# Altium project pressure_esp.PrjPcb
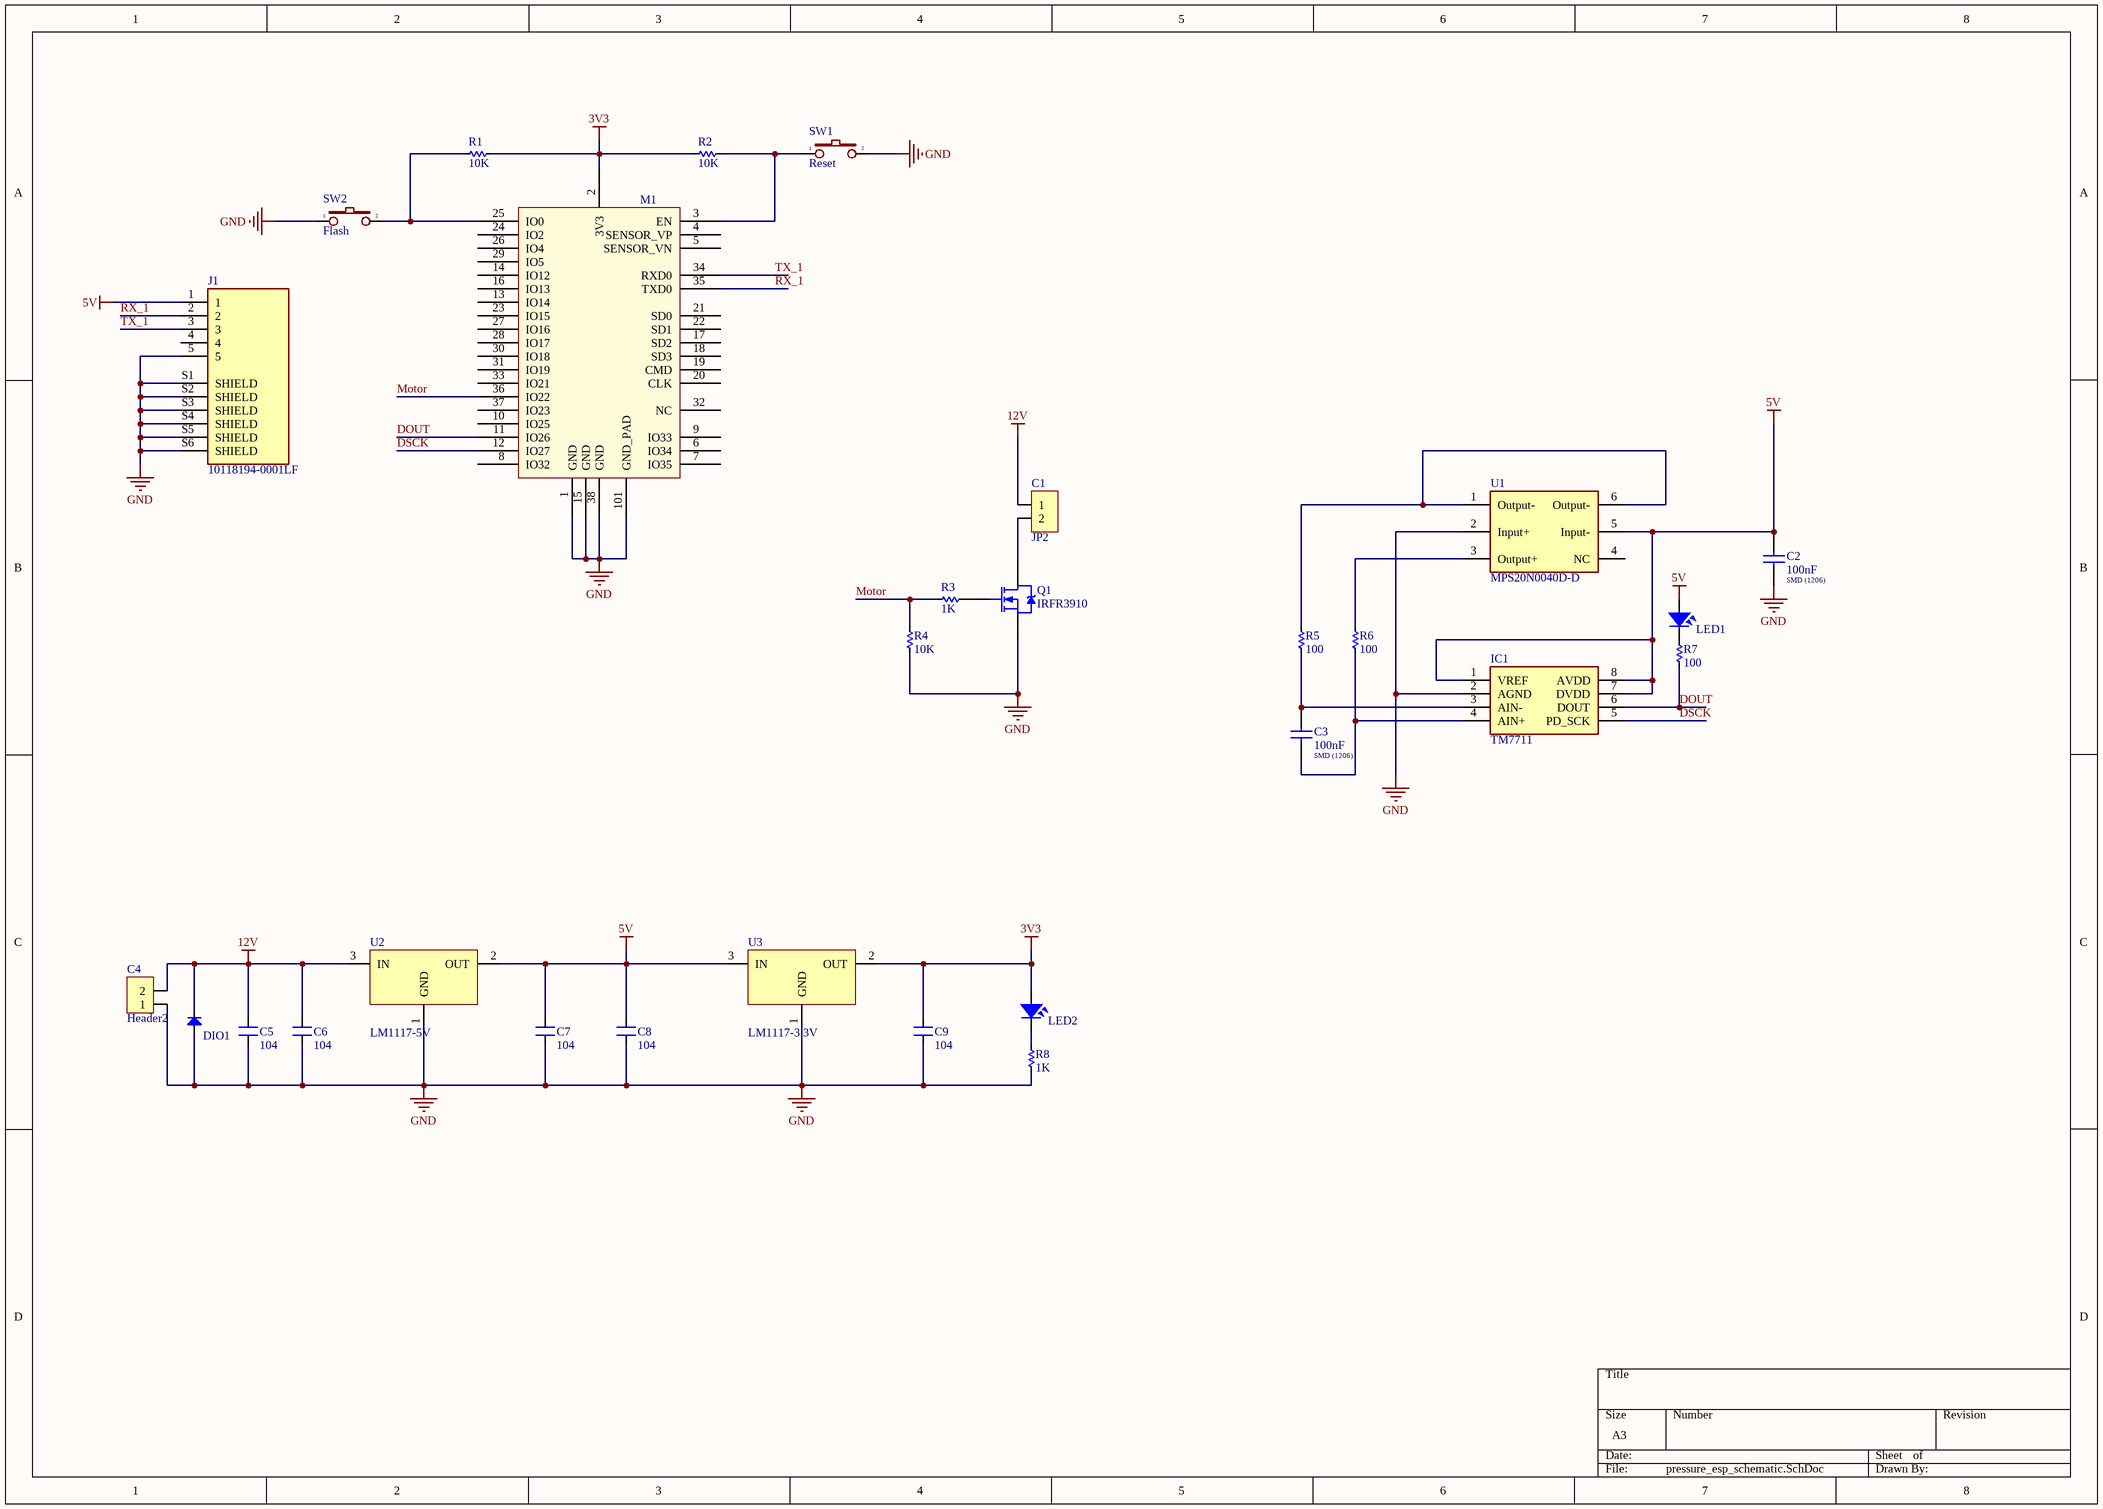
[diagram p0: pressure_esp_schematic.SchDoc]
1 sheet, 29 parts. Net scope: global (net labels, ports and power ports of the same name join across sheets).
Board file: pressure_esp_pcb.PcbDoc

## Sheet pressure_esp_schematic.SchDoc
size A3

### Parts
C1  JP2  [JP2-D1T]
C2  Valor: 100nF  Encapsulamento: SMD (1206)  [CAP_0603]  (hidden comment: Capacitor SMD)
C3  Valor: 100nF  Encapsulamento: SMD (1206)  [CAP_0603]  (hidden comment: Capacitor SMD)
C4  Header2  [Header2]
C5  104  [SM-CAP-0805]
C6  104  [SM-CAP-0805]
C7  104  [SM-CAP-0805]
C8  104  [SM-CAP-0805]
C9  104  [SM-CAP-0805]
DIO1  Diode SMD  [DIO-SMD-106]  (value not drawn)
IC1  TM7711  [SOIC127P600X196-8N]
J1  10118194-0001LF  [AMPHENOL_10118194-0001LF]
LED1  LED  [LED-0805-Blue]  (value not drawn)
LED2  LED  [LED-0805-Blue]  (value not drawn)
M1  ESP32S_Module  [ESP32S]  (value not drawn)
Q1  IRFR3910  [TO-252AA_N]
R1  10K  [RES-SMD-0603]
R2  10K  [RES-SMD-0603]
R3  1K  [RES-SMD-0603]
R4  10K  [RES-SMD-0603]
R5  100  [RES-SMD-0603]
R6  100  [RES-SMD-0603]
R7  100  [RES-SMD-0603]
R8  1K  [RES-SMD-0603]
SW1  Reset  [SW1-SMD]
SW2  Flash  [SW-DIP1-1]
U1  MPS20N0040D-D  [XDCR_ADP5241]
U2  LM1117-5V  [SOT223]
U3  LM1117-3.3V  [SOT223]

### Nets
3V3: C9.2 LED2.1 M1.2(3V3) R1.1 R2.2 U3.2(OUT)
5V: C2.2 C7.2 C8.2 IC1.1(VREF) IC1.7(DVDD) IC1.8(AVDD) J1.1 LED1.1 U1.5(Input-) U2.2(OUT) U3.3(IN)
12V: C1.1 C4.2 C5.2 C6.2 DIO1.2(K) U2.3(IN)
GND: C2.1 C4.1 C5.1 C6.1 C7.1 C8.1 C9.1 DIO1.1(A) IC1.2(AGND) J1.5 J1.S1(SHIELD) J1.S2(SHIELD) J1.S3(SHIELD) J1.S4(SHIELD) J1.S5(SHIELD) J1.S6(SHIELD) M1.1(GND) M1.15(GND) M1.38(GND) M1.101(GND_PAD) Q1.3(S) R4.2 R8.2 SW1.2 SW2.1 U1.2(Input+) U2.1(GND) U3.1(GND)
DOUT: IC1.6(DOUT) M1.11(IO26) R7.2
DSCK: IC1.5(PD_SCK) M1.12(IO27)
Motor: M1.36(IO22) R3.1 R4.1
RX_1: J1.2 M1.35(TXD0)
TX_1: J1.3 M1.34(RXD0)
NetC1_2: C1.2 Q1.4(D)
NetC3_1: C3.1 IC1.4(AIN+) R6.2
NetC3_2: C3.2 IC1.3(AIN-) R5.2
NetLED1_2: LED1.2 R7.1
NetLED2_2: LED2.2 R8.1
NetM1_3: M1.3(EN) R2.1 SW1.1
NetM1_25: M1.25(IO0) R1.2 SW2.2
NetQ1_1: Q1.1(G) R3.2
NetR5_1: R5.1 U1.1(Output-) U1.6(Output-)
NetR6_1: R6.1 U1.3(Output+)

Not connected (* = marked no-connect by the designer): J1 4; M1 4(SENSOR_VP) 5(SENSOR_VN) 6(IO34) 7(IO35) 8(IO32) 9(IO33) 10(IO25) 13(IO14) 14(IO12) 16(IO13) 17(SD2) 18(SD3) 19(CMD) 20(CLK) 21(SD0) 22(SD1) 23(IO15) 24(IO2) 26(IO4) 27(IO16) 28(IO17) 29(IO5) 30(IO18) 31(IO19) 32(NC) 33(IO21) 37(IO23); U1 4(NC)

### Library data of the parts
C1 = JP2: WR-PHD 2.54 mm Angled Socket Header; Manufacturer: W¨¹rth Elektronik eiSos GmbH; partNo: 613002143121; ComponentLink1 Description: Manufacturer; ComponentLink2 Description: Datasheet; NoPins: 02; Created Date: 29 March 2013; ComponentLink1URL: http://www.we-online.com; ComponentLink2URL: http://katalog.we-online.de/em/datasheet/6130xx143121.pdf; Created by: Karrer Zheng
C4 = Header2: Header IDC, 2 x 1 Pin Vertical 2.54mm Pitch (Non-Boxed, Male); Manufacturer: W¨¹rth Elektronik eiSos GmbH; partNo: 613002143121; ComponentLink1 Description: Manufacturer; ComponentLink2 Description: Datasheet; NoPins: 02; Created Date: 29 March 2013; ComponentLink1URL: http://www.we-online.com; ComponentLink2URL: http://katalog.we-online.de/em/datasheet/6130xx143121.pdf; Created by: Karrer Zheng
C5-C9 = CN: Value: 0,1uF/300V; Designed by: VanDungEvn
DIO1 = Diode SMD: Default Diode; Code - JEDEC: DO-214-AB; Value: 1N5007; Published: 8-Jun-2000; Revision: July-2002: Re-released for DXP Platform.; Publisher: Altium Limited
IC1 = TM7711: Integrated Circuit; Manufacturer_Name: Shenzhen Titan Micro Elec; Datasheet Link: https://datasheet.lcsc.com/szlcsc/Shenzhen-Titan-Micro-Elec-TM7711_C80695.pdf; Height: 1.96mm; Manufacturer_Part_Number: TM7711
J1 = 10118194-0001LF: USB - micro B USB 2.0 Receptacle Connector 5 Position Surface Mount, Right Angle; Through Hole; MF: Amphenol ICC; Package: None; Price: None; Availability: Unavailable; MP: 10118194-0001LF; SnapEDA_Link: https://www.snapeda.com/parts/10118194-0001LF/Amphenol%20FCI/view-part/1413308/?ref=snap; Value: *
LED1 LED2 = LED SMD: Value: LED 3 - 5 ly 2 Colour
M1 = ESP32S_Module: Esp-32S; Datasheet: https://espressif.com/sites/default/files/documentation/esp_wroom_32_datasheet_en.pdf
Q1 = IRFR3910: HEXFET Power MOSFET; Note: Pin 2 is trimmed and is electrically connected to Drain.; Published: 8-Jun-2000; LatestRevisionDate: 20-Nov-2009; LatestRevisionNote: IPC-7351 Footprint Added.; DatasheetVersion: May-1998; PackageVersion: Feb-2003; PackageReference: TO-252AA; Publisher: Altium Limited; PackageDescription: 3-Pin HEXFET Package 2.28 mm Pitch, 9.9 mm Lead Span; Code_JEDEC: TO-252-AA; ComponentLink1Description: Manufacturer Link; ComponentLink1URL: http://www.irf.com/; ComponentLink2Description: Datasheet; ComponentLink2URL: http://www.irf.com/product-info/datasheets/data/irfr3910.pdf
R1-R8 = Res-SMD: Resistor; Manufacturer: Generic Components; Class: Passive; Published: 08/06/2000; Publisher: Altium Hobart Technology Centre
SW1 SW2 = SW2: Switch button 2 pin; Value: SW chip 2 pin
U1 = MPS20N0040D-D: Pressure Sensor 14.5PSI (100kPa) Vented Gauge Male - 0.12 (3mm) Tube 0 V ~ 4.5 V 6-SMD Module; MP: ADP5241; MF: Panasonic; SnapEDA_Link: https://www.snapeda.com/parts/ADP5241/Panasonic/view-part/382466/?ref=snap; Availability: Bad; Purchase-URL: https://pricing.snapeda.com/search/part/ADP5241/?ref=eda; Check_prices: https://www.snapeda.com/parts/ADP5241/Panasonic/view-part/382466/?ref=eda; Price: None; Value: *; Package: SMD-6 Panasonic
U2 U3 = LM1117: 800mA Low-Dropout Linear Regulator; Creator: Nguyen Ba Bien; Website: http://group3i.net
C2 C3 = Capacitor SMD: Descrição: Capacitor SMD; Marca: *; Modelo: *; Observação: *